# EAGLE design FXAS21002_gyro (EAGLE 9.3.2)
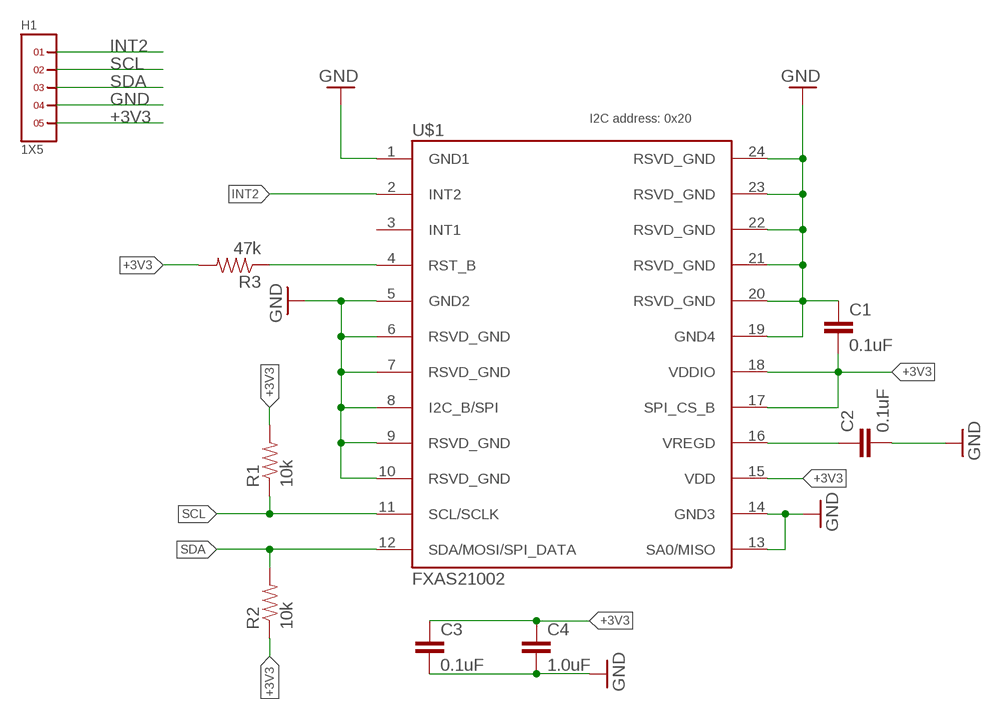
[diagram p0: schematic, sheet 1]

## Parts
C1  0.1uF  CAP0805  [0805]
C2  0.1uF  CAP0805  [0805]
C3  0.1uF  CAP0805  [0805]
C4  1.0uF  CAP0805  [0805]
H1  1X5  [1X5]
R1  10k  RESISTOR0805-RES  [0805]
R2  10k  RESISTOR0805-RES  [0805]
R3  47k  RESISTOR0805-RES  [0805]
U$1  FXAS21002  [24QFN]

## Nets
+3V3: C1.2 C3.1 C4.1 H1.5 R1.2 R2.1 R3.2 U$1.15(VDD) U$1.17(SPI_CS_B) U$1.18(VDDIO)
GND: C1.1 C2.2 C3.2 C4.2 H1.4 U$1.1(GND1) U$1.5(GND2) U$1.6(RSVD_GND) U$1.7(RSVD_GND) U$1.8(I2C_B/SPI) U$1.9(RSVD_GND) U$1.10(RSVD_GND) U$1.13(SA0/MISO) U$1.14(GND3) U$1.19(GND4) U$1.20(RSVD_GND) U$1.21(RSVD_GND) U$1.22(RSVD_GND) U$1.23(RSVD_GND) U$1.24(RSVD_GND)
INT2: H1.1 U$1.2(INT2)
N$1: C2.1 U$1.16(VREGD)
N$4: R3.1 U$1.4(RST_B)
SCL: H1.2 R1.1 U$1.11(SCL/SCLK)
SDA: H1.3 R2.2 U$1.12(SDA/MOSI/SPI_DATA)
Unconnected: U$1.3(INT1)

## Notes on the sheet
- I2C address: 0x20

## Library data of the parts
C1-C4 = SparkFun-Passives:CAP: Capacitor Standard 0603 ceramic capacitor, and 0.1" leaded capacitor.
H1 = headers(.1in):1X5
R1-R3 = SparkFun-Passives:RESISTOR: Resistor Basic schematic elements and footprints for 0603, 1206, and PTH resistors.
U$1 = sharkdunio:FXAS21002: FXAS21002 I2C/SPI low power gyro

## Board
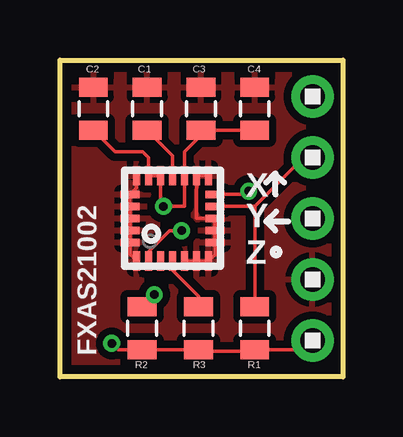
[diagram p1: board, top side]
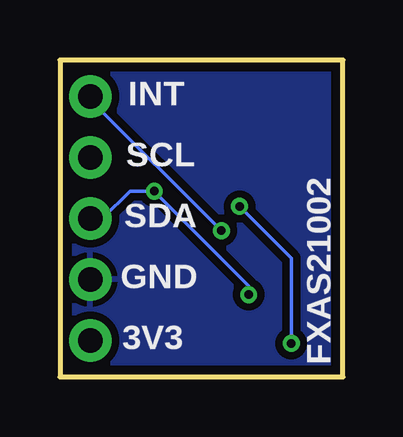
[diagram p2: board, bottom side, seen from below]

Size 11.81 x 13.21 mm. Coordinates in mm from the lower left corner, seen from the top.
Outline: 0,0 0,13.21 11.81,13.21 11.81,0 0,0
Copper layers (1*16): Top 0.0356mm / dielectric 1.5011mm / Bottom 0.0356mm
Design rules "oshpark-2layer": minimum track width 6mil, minimum drill 13mil, track to track 6mil, track to pad 6mil, pad to pad 6mil, via to via 6mil, smd to smd 6mil, copper to edge 15mil, drill to drill 6mil, minimum pad ring 7mil, minimum via ring 7mil, stop-mask expansion 2.5mil, vias tented up to drill 0mil, thermal gap 10mil

### Footprints (pad centres in the part's own frame; a part is rotated, then mirrored left to right if it is on the bottom)
0805 = smd 0.8 x 1.2: 1 -0.9,0; 2 0.9,0
1X5 = drill 1.016 pad 1.778: 1 0,0; 2 2.54,0; 3 5.08,0; 4 7.62,0; 5 10.16,0
24QFN = smd 0.8 x 0.3: 1 -1.775,1.5; 2 -1.775,1; 3 -1.775,0.5; 4 -1.775,0; 5 -1.775,-0.5; 6 -1.775,-1; 7 -1.775,-1.5; 13 1.775,-1.5; 14 1.775,-1; 15 1.775,-0.5; 16 1.775,0; 17 1.775,0.5; 18 1.775,1; 19 1.775,1.5 | smd 0.3 x 0.8: 8 -1,-1.775; 9 -0.5,-1.775; 10 0,-1.775; 11 0.5,-1.775; 12 1,-1.775; 20 1,1.775; 21 0.5,1.775; 22 0,1.775; 23 -0.5,1.775; 24 -1,1.775

### Placement (x,y rotation side)
C1  1.4,11.18 270 top
C2  3.64,11.18 90 top
C3  5.88,11.18 90 top
C4  8.13,11.18 90 top
H1  10.54,11.68 270 top
R1  8.13,2.03 270 top
R2  3.43,2.03 90 top
R3  5.78,2.03 270 top
U$1  4.7,6.6 90 top

### Tracks (layer width: path | path; a pad name or v marks a point on that pad's centre or on a via)
+3V3  (via drill 0.35)
  Top 0.152: 4.19,7.24 U$1.17 4.19,8.39 4.18,8.38 U$1.18 | 4.19,7.24 4.19,7.11 5.2,7.11 U$1.15 5.2,9.39 5.88,10.07 C3.1 C4.1 | R3.2 R2.1 2.42,1.13 v2.16,1.4 | 8.07,1.07 R1.2 10.15,1.13 H1.5 | 8.07,1.07 8,1 | 4.19,7.24 v4.32,7.11 | R3.2 5.66,1.02 | R3.2 5.84,1.07 8.07,1.07 | U$1.18 | U$1.18 3.7,9.13 3.44,9.39 2.3,9.39 1.52,10.16 1.51,10.16 C1.2
  Bottom 0.152: v4.32,7.11 2.16,4.95 v2.16,1.4
GND
  Top 0.152: U$1.20 2.91,7.62 | U$1.20 3.2,7.88 U$1.19 3.18,8.4 | U$1.13 U$1.14 5.7,6.62 5.71,6.6 U$1.10 U$1.9 | U$1.20 U$1.21 U$1.22 U$1.23 U$1.24 2.92,5.1 U$1.1 arc90 3.18,4.8 | U$1.9 | U$1.5 U$1.6 U$1.7 6.49,5.12 6.49,5.59 U$1.8 U$1.9 | C3.2 5.89,12.06 | 8.12,12.06 C4.2
  pour Bottom (isolate 0.305): 0,13.21 11.81,13.21 11.81,0 0,0
  pour Top (isolate 0.305): 0,13.21 0,0 11.81,0 11.81,13.21
INT2  (via drill 0.35)
  Top 0.152: 3.68,4.81 U$1.2 3.7,5.22 4.57,6.1 v5.08,6.1
  Bottom 0.152: H1.1 10.54,11.56 v5.08,6.1
N$1
  Top 0.152: C2.1 4.7,9.22 U$1.16
N$4
  Top 0.152: 5.53,2.93 R3.1 5.78,3.37 4.7,4.45 U$1.4
SCL
  Top 0.152: R1.1 8.13,7.11 | 8.13,7.11 10.16,9.14 H1.2 | U$1.11 8.13,7.11
SDA  (via drill 0.35)
  Top 0.152: U$1.12 arc-90 6.49,7.62 7.75,7.62 v7.87,7.75 | H1.3 9.91,6.6 | v3.94,3.43 R2.2
  Bottom 0.152: H1.3 10.03,6.6 8.89,7.75 v7.87,7.75 3.94,3.81 v3.94,3.43

### Text on the board
tPlace: C2 | C1 | C3 | C4 | X | Y | Z | FXAS21002 | R2 | R3 | R1
bPlace: INT | SCL | SDA | GND | 3V3 | FXAS21002